# Altium schematic sheet Sheet3-power.SchDoc
size A4; SheetNumber: 4; SheetTotal: 4
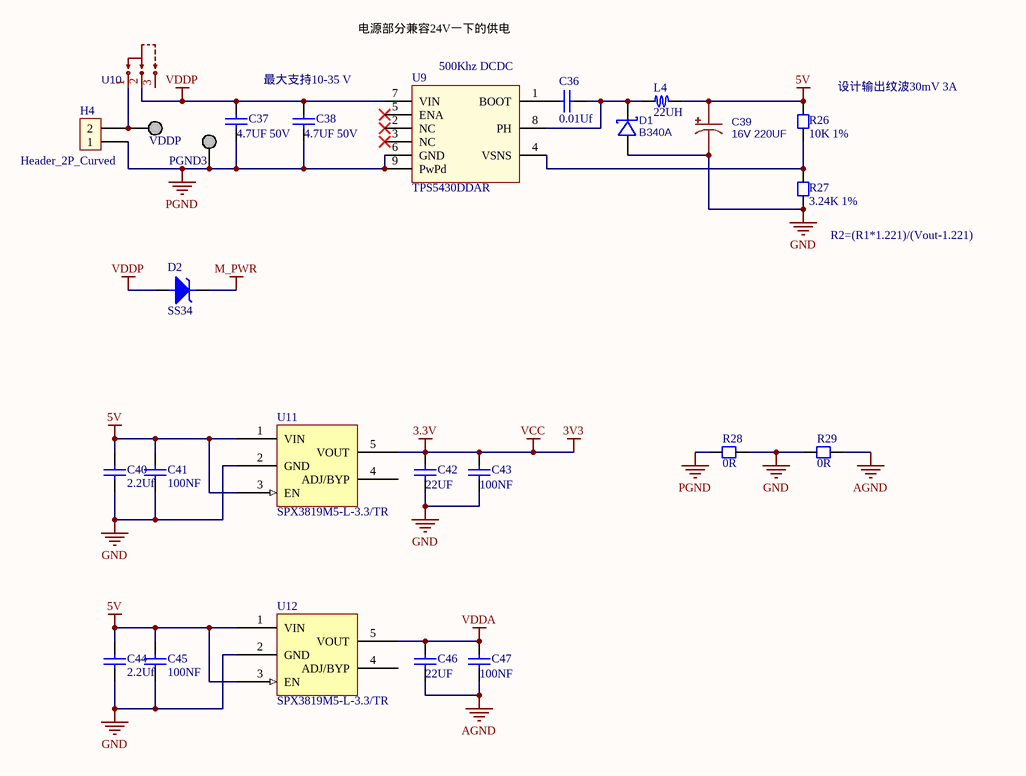
[diagram p0: Sheet3-power.SchDoc]

## Parts
C36  0.01Uf  [CC1608-0603]
C37  4.7UF 50V  [CC1608-0603]
C38  4.7UF 50V  [CC1608-0603]
C39  16V 220UF  [CAP-SMD_D6.3]
C40  2.2Uf  [CC1608-0603]
C41  100NF  [CC1608-0603]
C42  22UF  [CC1608-0603]
C43  100NF  [CC1608-0603]
C44  2.2Uf  [CC1608-0603]
C45  100NF  [CC1608-0603]
C46  22UF  [CC1608-0603]
C47  100NF  [CC1608-0603]
D1  B340A  [DO-214 AA]
D2  SS34  [DO-214 AA]
H4  Header_2P_Curved  [Header_2_54_2PW]
L4  22UH  [Inductor-1040]
PGND3  test  [test]  (value not drawn)
R26  10K 1%  [CR1608-0603]
R27  3.24K 1%  [CR1608-0603]
R28  0R  [CR1608-0603]
R29  0R  [CR1608-0603]
U9  TPS5430DDAR  [SOIC-8-E]
U10  HX SS12D10G4  [SW-TH_3P-SS12D06]  (value not drawn)
U11  SPX3819M5-L-3.3/TR  [SOT23-5]
U12  SPX3819M5-L-3.3/TR  [SOT23-5]
VDDP  test  [test]  (value not drawn)

## Nets
3.3V: C42.1 C43.1 U11.5(VOUT)  [also labelled 3V3, VCC]
5V: C39.1 C40.2 C41.2 C44.2 C45.2 L4.2 R26.2 U11.1(VIN) U11.3(EN) U12.1(VIN) U12.3(EN)
AGND: C46.2 C47.2 R29.1
GND: C39.2 C40.1 C41.1 C42.2 C43.2 C44.1 C45.1 D1.2(A) R27.1 R28.1 R29.2 U11.2(GND) U12.2(GND)
M_PWR: D2.1(K)
PGND: C37.2 C38.2 H4.1 PGND3.0 R28.2 U9.6(GND) U9.9(PwPd)
VDDA: C46.1 C47.1 U12.5(VOUT)
VDDP: C37.1 C38.1 D2.2(A) U9.7(VIN) U10.2
NetC36_1: C36.1 U9.1(BOOT)
NetC36_2: C36.2 D1.1(K) L4.1 U9.8(PH)
NetH4_2: H4.2 U10.1 VDDP.0
NetR26_1: R26.1 R27.2 U9.4(VSNS)

Not connected (* = marked no-connect by the designer): U9 2(NC)* 3(NC)* 5(ENA)*; U10 3; U11 4(ADJ/BYP); U12 4(ADJ/BYP)

## Notes on the sheet
- 电源部分兼容24V一下的供电
- 最大支持10-35 V
- (near U9) 500Khz DCDC
- (near R26) 设计输出纹波30mV 3A
- (near R27) R2=(R1*1.221)/(Vout-1.221)

## Library data of the parts
C36-C38 C42 C43 C46 C47 = Chip capacitor: 贴片电容
C39 = Cap ECAP SMD: 铝点解电容; BOM_Manufacturer: PANASONIC; BOM_Manufacturer Part: EEEFP1C681AP; nameAlias: Capacitance; Contributor: LCSC; BOM_Supplier: LCSC; BOM_Supplier Part: C413527; spicePre: C; spiceSymbolName: EEEFP1C681AP
C40 C41 C44 C45 = Cap Chip 0603: 0603封装的电容; Published: 8-Jun-2000; Revision: July-2002: Re-released for DXP Platform.; Publisher: Altium Limited
D1 = B340A: 40V 3A 550mV@3A; BOM_Manufacturer: MDD; BOM_Supplier: LCSC; BOM_Manufacturer Part: B340A; BOM_Supplier Part: C64982; BOM_JLCPCB Part Class: Extended Part; spicePre: D; spiceSymbolName: B340A
D2 = SS34: 肖特基二极管
H4 = Header_2P_Curved: 弯的2P排针
L4 = Inductor-1040: 1040封装 一体成型 贴片 功率电感
PGND3 VDDP = test: 测试点
R26 R27 = Chip resistor: 贴片电阻
R28 R29 = Resistor Chip 0603: 0603封装电阻; Published: 8-Jun-2000; Revision: July-2002: Re-released for DXP Platform.; Publisher: Altium Limited
U9 = TPS5430DDAR: 宽电压DCDC降压IC
U10 = SW-TH_3P-SS12D06: BOM_Manufacturer: hanxia(韩下); Contributor: lcsc; BOM_Supplier: LCSC; BOM_Supplier Part: C5149841; BOM_Manufacturer Part: HX SS12D10G4; link: https://atta.szlcsc.com/upload/public/pdf/source/20220907/2020D7183ED16DD6E2B9F5A13FB144CF.pdf; BOM_JLCPCB Part Class: Extended Part; spicePre: U; spiceSymbolName: HX SS12D10G4
U11 U12 = SPX3819M5-L-3.3/TR: LDO 3.3V , SOT-23-5 500ma